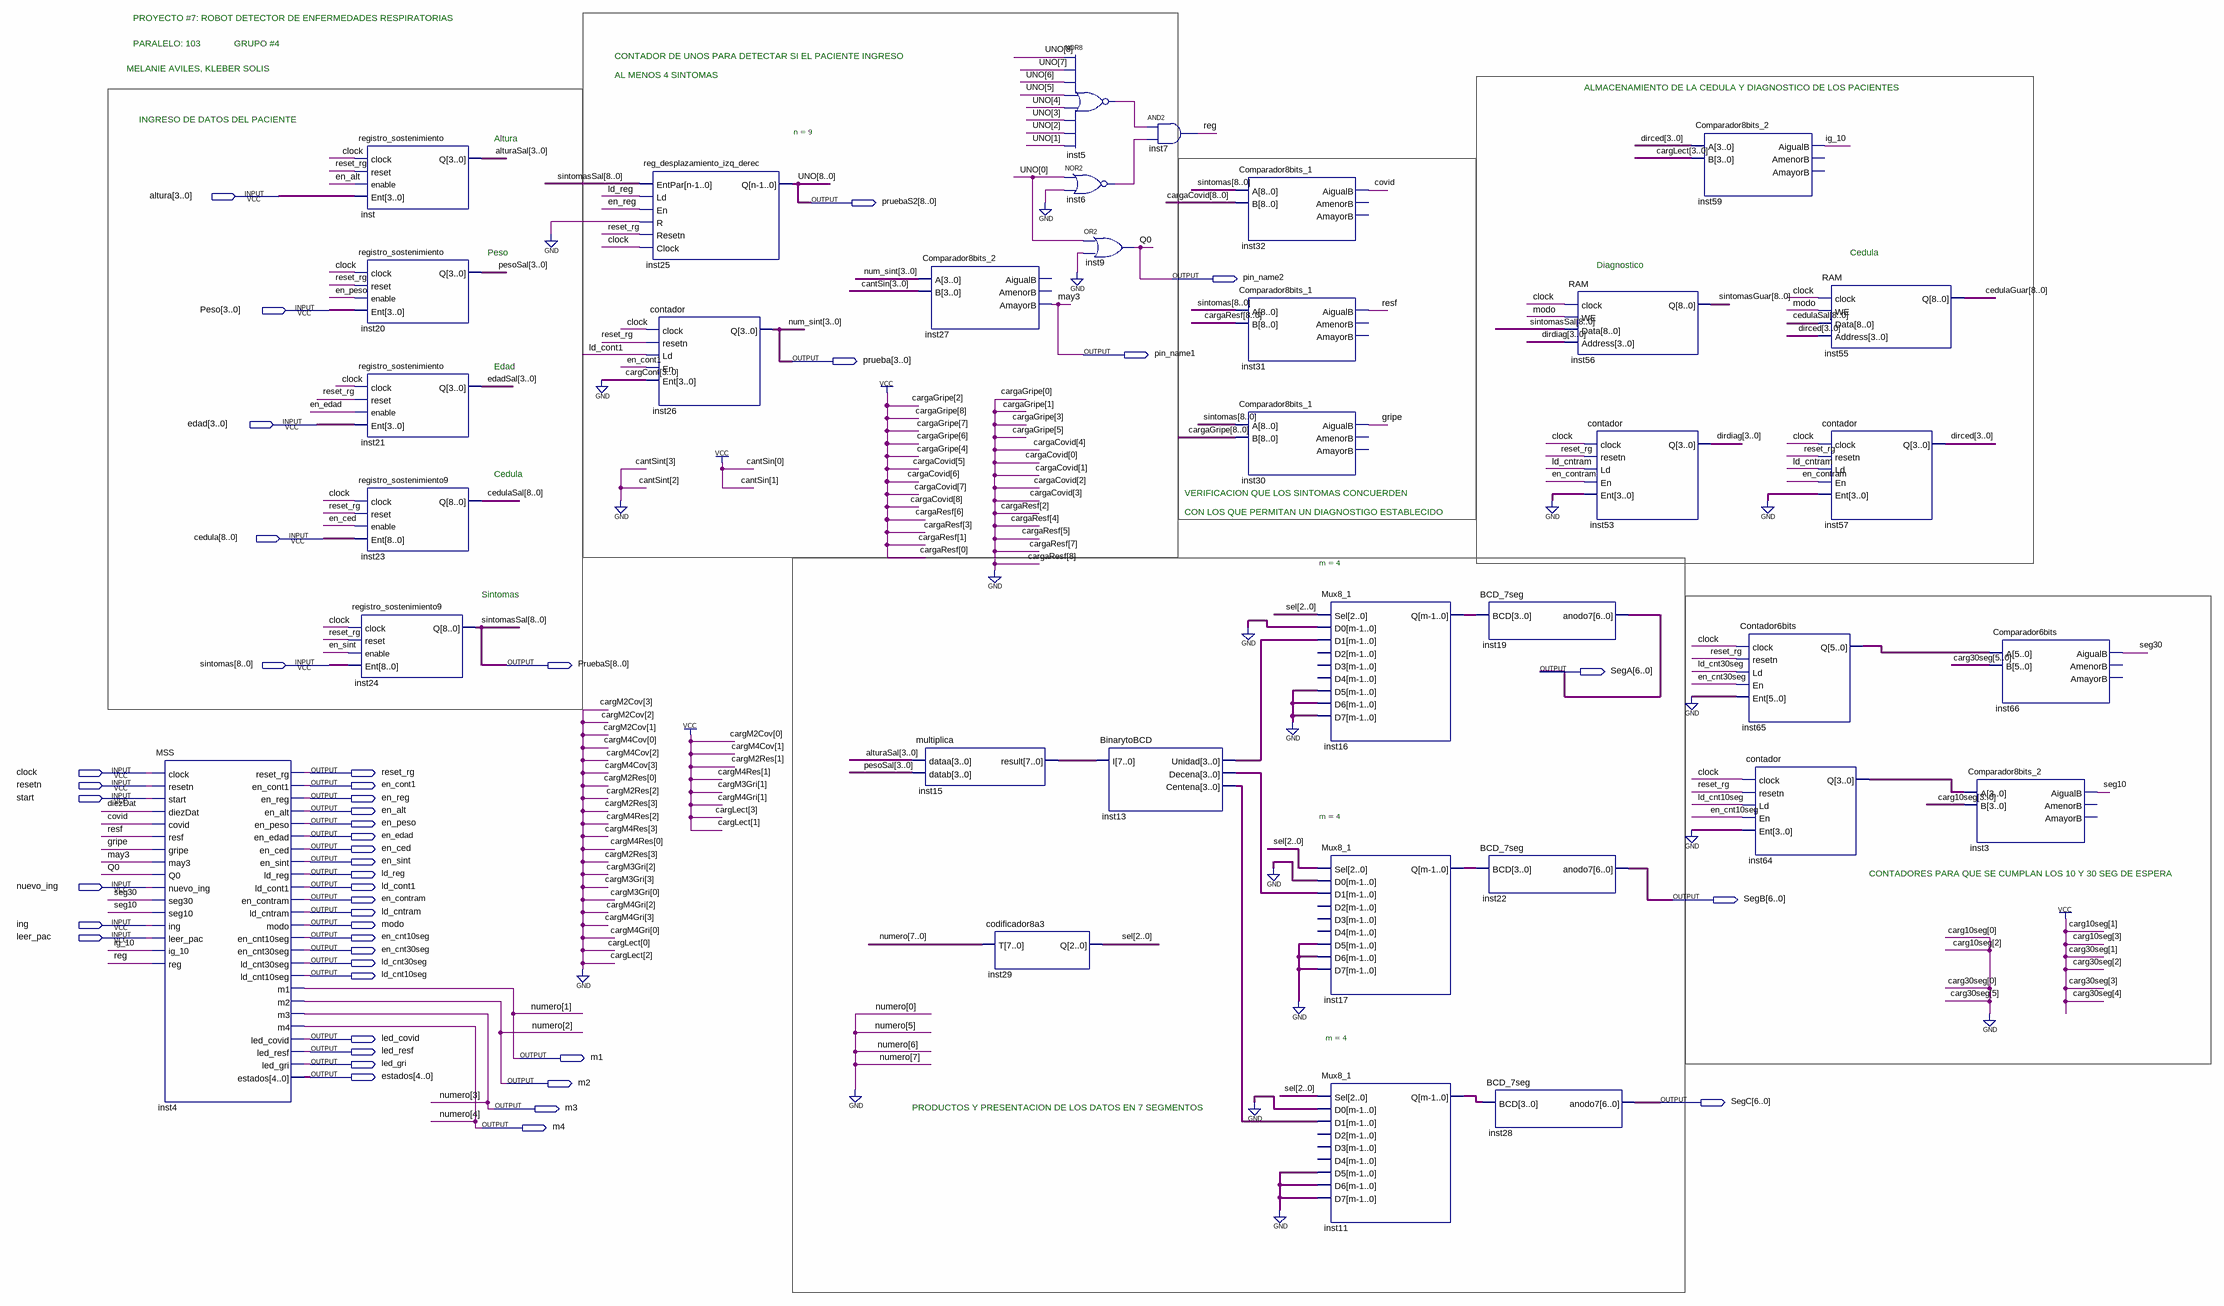
[diagram p0: schematic sheet]
// Quartus schematic ProyectoSd2.bdf as structural Verilog: 34 symbols, 44 pins
module ProyectoSd2 (
  input  [3:0] altura,
  input  [3:0] Peso,
  input  [3:0] edad,
  input  [8:0] cedula,
  input  [8:0] sintomas,
  input  clock,
  input  resetn,
  input  start,
  input  nuevo_ing,
  input  ing,
  input  leer_pac,
  output [8:0] pruebaS2,
  output pin_name2,
  output pin_name1,
  output [3:0] prueba,
  output [8:0] PruebaS,
  output [6:0] SegA,
  output reset_rg,
  output en_cont1,
  output en_reg,
  output en_alt,
  output en_peso,
  output en_edad,
  output en_ced,
  output en_sint,
  output ld_reg,
  output ld_cont1,
  output en_contram,
  output [6:0] SegB,
  output ld_cntram,
  output modo,
  output en_cnt10seg,
  output en_cnt30seg,
  output ld_cnt30seg,
  output ld_cnt10seg,
  output led_covid,
  output led_resf,
  output m1,
  output led_gri,
  output [4:0] estados,
  output m2,
  output [6:0] SegC,
  output m3,
  output m4
);

  wire covid, diezDat, gripe, ig_10, inst5_out, inst6_out, \reg , resf, seg10, seg30;
  wire [2:0] sel;
  wire [3:0] alturaSal, dirced, dirdiag, edadSal, inst11_q, inst13_centena, inst13_decena, inst13_unidad,
       inst16_q, inst17_q, inst64_q, pesoSal;
  wire [3:2] cantSin;
  wire [5:0] inst65_q;
  wire [7:0] inst15_result;
  wire [8:0] cedulaGuar, cedulaSal, sintomasGuar;

  MSS inst4 (
    .clock(clock), .resetn(resetn), .start(start), .diezDat(diezDat), .covid(covid), .resf(resf),
    .gripe(gripe), .may3(pin_name1), .Q0(pin_name2), .nuevo_ing(nuevo_ing), .seg30(seg30), .seg10(seg10),
    .ing(ing), .leer_pac(leer_pac), .ig_10(ig_10), .\reg (\reg ), .reset_rg(reset_rg), .en_cont1(en_cont1),
    .en_reg(en_reg), .en_alt(en_alt), .en_peso(en_peso), .en_edad(en_edad), .en_ced(en_ced),
    .en_sint(en_sint), .ld_reg(ld_reg), .ld_cont1(ld_cont1), .en_contram(en_contram), .ld_cntram(ld_cntram),
    .modo(modo), .en_cnt10seg(en_cnt10seg), .en_cnt30seg(en_cnt30seg), .ld_cnt30seg(ld_cnt30seg),
    .ld_cnt10seg(ld_cnt10seg), .m1(m1), .m2(m2), .m3(m3), .m4(m4), .led_covid(led_covid),
    .led_resf(led_resf), .led_gri(led_gri), .estados(estados));
  registro_sostenimiento inst (.clock(clock), .reset(reset_rg), .enable(en_alt), .Ent(altura), .Q(alturaSal));
  registro_sostenimiento inst20 (.clock(clock), .reset(reset_rg), .enable(en_peso), .Ent(Peso), .Q(pesoSal));
  registro_sostenimiento inst21 (.clock(clock), .reset(reset_rg), .enable(en_edad), .Ent(edad), .Q(edadSal));
  registro_sostenimiento9 inst23 (.clock(clock), .reset(reset_rg), .enable(en_ced), .Ent(cedula), .Q(cedulaSal));
  registro_sostenimiento9 inst24 (.clock(clock), .reset(reset_rg), .enable(en_sint), .Ent(sintomas), .Q(PruebaS));
  reg_desplazamiento_izq_derec #(.n(9)) inst25 (
    .EntPar(PruebaS), .Ld(ld_reg), .En(en_reg), .R(1'b0), .Resetn(reset_rg), .Clock(clock), .Q(pruebaS2));
  contador inst26 (.clock(clock), .resetn(reset_rg), .Ld(ld_cont1), .En(en_cont1), .Ent(4'b0000), .Q(prueba));
  Comparador8bits_2 inst27 (.A(prueba), .B({cantSin, 2'b11}), .AmayorB(pin_name1));  // open: AigualB, AmenorB
  multiplica inst15 (.dataa(alturaSal), .datab(pesoSal), .result(inst15_result));
  codificador8a3 inst29 (.T({3'b000, m4, m3, m2, m1, 1'b0}), .Q(sel));
  nor inst5 (inst5_out, pruebaS2[8], pruebaS2[7], pruebaS2[6], pruebaS2[5], pruebaS2[4], pruebaS2[3], pruebaS2[2], pruebaS2[1]);
  nor inst6 (inst6_out, pruebaS2[0], 1'b0);
  or inst9 (pin_name2, pruebaS2[0], 1'b0);
  BinarytoBCD inst13 (.I(inst15_result), .Unidad(inst13_unidad), .Decena(inst13_decena), .Centena(inst13_centena));
  and inst7 (\reg , inst5_out, inst6_out);
  Comparador8bits_1 inst32 (.A(sintomas), .B(9'b111100000), .AigualB(covid));  // open: AmenorB, AmayorB
  Comparador8bits_1 inst31 (.A(sintomas), .B(9'b001001011), .AigualB(resf));  // open: AmenorB, AmayorB
  Comparador8bits_1 inst30 (.A(sintomas), .B(9'b111010100), .AigualB(gripe));  // open: AmenorB, AmayorB
  Mux8_1 #(.m(4)) inst16 (
    .Sel(sel), .D0(4'b0000), .D1(inst13_unidad), .D5(4'b0000), .D6(4'b0000), .D7(4'b0000), .Q(inst16_q));  // open: D2, D3, D4
  Mux8_1 #(.m(4)) inst17 (
    .Sel(sel), .D0(4'b0000), .D1(inst13_decena), .D5(4'b0000), .D6(4'b0000), .D7(4'b0000), .Q(inst17_q));  // open: D2, D3, D4
  Mux8_1 #(.m(4)) inst11 (
    .Sel(sel), .D0(4'b0000), .D1(inst13_centena), .D5(4'b0000), .D6(4'b0000), .D7(4'b0000), .Q(inst11_q));  // open: D2, D3, D4
  BCD_7seg inst19 (.BCD(inst16_q), .anodo7(SegA));
  BCD_7seg inst22 (.BCD(inst17_q), .anodo7(SegB));
  BCD_7seg inst28 (.BCD(inst11_q), .anodo7(SegC));
  RAM inst56 (.clock(clock), .WE(modo), .Data(PruebaS), .Address(dirdiag), .Q(sintomasGuar));
  contador inst53 (.clock(clock), .resetn(reset_rg), .Ld(ld_cntram), .En(en_contram), .Ent(4'b0000), .Q(dirdiag));
  Comparador8bits_2 inst59 (.A(dirced), .B(4'b1010), .AigualB(ig_10));  // open: AmenorB, AmayorB
  Contador6bits inst65 (
    .clock(clock), .resetn(reset_rg), .Ld(ld_cnt30seg), .En(en_cnt30seg), .Ent({6{1'b0}}), .Q(inst65_q));
  contador inst64 (.clock(clock), .resetn(reset_rg), .Ld(ld_cnt10seg), .En(en_cnt10seg), .Ent(4'b0000), .Q(inst64_q));
  RAM inst55 (.clock(clock), .WE(modo), .Data(cedulaSal), .Address(dirced), .Q(cedulaGuar));
  contador inst57 (.clock(clock), .resetn(reset_rg), .Ld(ld_cntram), .En(en_contram), .Ent(4'b0000), .Q(dirced));
  Comparador6bits inst66 (.A(inst65_q), .B(6'b011110), .AigualB(seg30));  // open: AmenorB, AmayorB
  Comparador8bits_2 inst3 (.A(inst64_q), .B(4'b1010), .AigualB(seg10));  // open: AmenorB, AmayorB

  // Other names for the same wires on the sheet: numero[4:1] = {m4, m3, m2, m1}; may3 = pin_name1; Q0 = pin_name2;
  //   num_sint[3:0] = prueba; sintomasSal[8:0] = PruebaS; UNO[8:0] = pruebaS2

  // Notes on the sheet:
  //   PROYECTO #7: ROBOT DETECTOR DE ENFERMEDADES RESPIRATORIAS
  //   PARALELO: 103
  //   GRUPO #4
  //   CONTADOR DE UNOS PARA DETECTAR SI EL PACIENTE INGRESO
  //   MELANIE AVILES, KLEBER SOLIS
  //   AL MENOS 4 SINTOMAS
  //   ALMACENAMIENTO DE LA CEDULA Y DIAGNOSTICO DE LOS PACIENTES
  //   INGRESO DE DATOS DEL PACIENTE
  //   Altura
  //   Peso
  //   Cedula
  //   Diagnostico
  //   Edad
  //   Cedula
  //   VERIFICACION QUE LOS SINTOMAS CONCUERDEN
  //   CON LOS QUE PERMITAN UN DIAGNOSTIGO ESTABLECIDO
  //   Sintomas
  //   CONTADORES PARA QUE SE CUMPLAN LOS 10 Y 30 SEG DE ESPERA
  //   PRODUCTOS Y PRESENTACION DE LOS DATOS EN 7 SEGMENTOS
endmodule
